# EAGLE schematic Schema_Electronique_Bracelet (EAGLE 9.6.2)
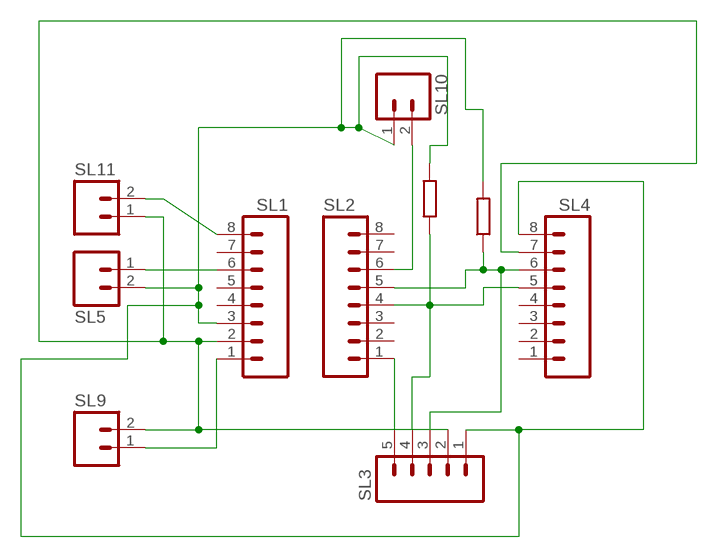
[diagram p0: schematic, sheet 1]

## Parts
SL1  ESP32_LEFT  MA08  [08PA]
SL2  ESP32_RIGHT  MA08  [08PA]
SL3  MAX30102  MA05  [05PA]
SL4  MPU6050  MA08  [08PA]
SL5  BUZZER  MA02  [02PA]
SL9  ON_OFF_SWITCH  MA02  [02PA]
SL10  POWER_INPUT  MA02  [02PA]
SL11  POWER_INPUT  MA02  [02PA]

## Nets
LED: SL1.2 SL3.2 SL4.7 SL9.2 SL11.1
N$2: SL1.8 SL11.2
N$3: SL1.1 SL9.1
N$4: SL1.6 SL5.1
N$6: SL1.3 SL3.1 SL4.8 SL5.2 SL10.1
N$9: SL2.6 SL10.2
N$14: SL2.1 SL3.5
NC_MPU_XCL: SL2.5 SL3.3 SL4.6
NC_MPU_XDA: SL2.4 SL3.4 SL4.5
Unconnected: SL1.4 SL1.5 SL1.7 SL2.2 SL2.3 SL2.7 SL2.8 SL4.1 SL4.2 SL4.3 SL4.4

## Library data of the parts
SL1 SL2 SL4 = con-amp-quick:MA08: AMP QUICK CONNECTOR; OC_FARNELL: unknown; OC_NEWARK: unknown
SL3 = con-amp-quick:MA05: AMP QUICK CONNECTOR; OC_FARNELL: unknown; OC_NEWARK: unknown
SL5 SL9-SL11 = con-amp-quick:MA02: AMP QUICK CONNECTOR; OC_FARNELL: unknown; OC_NEWARK: unknown